# EAGLE design FuenteProto_v11 (EAGLE 6.2)
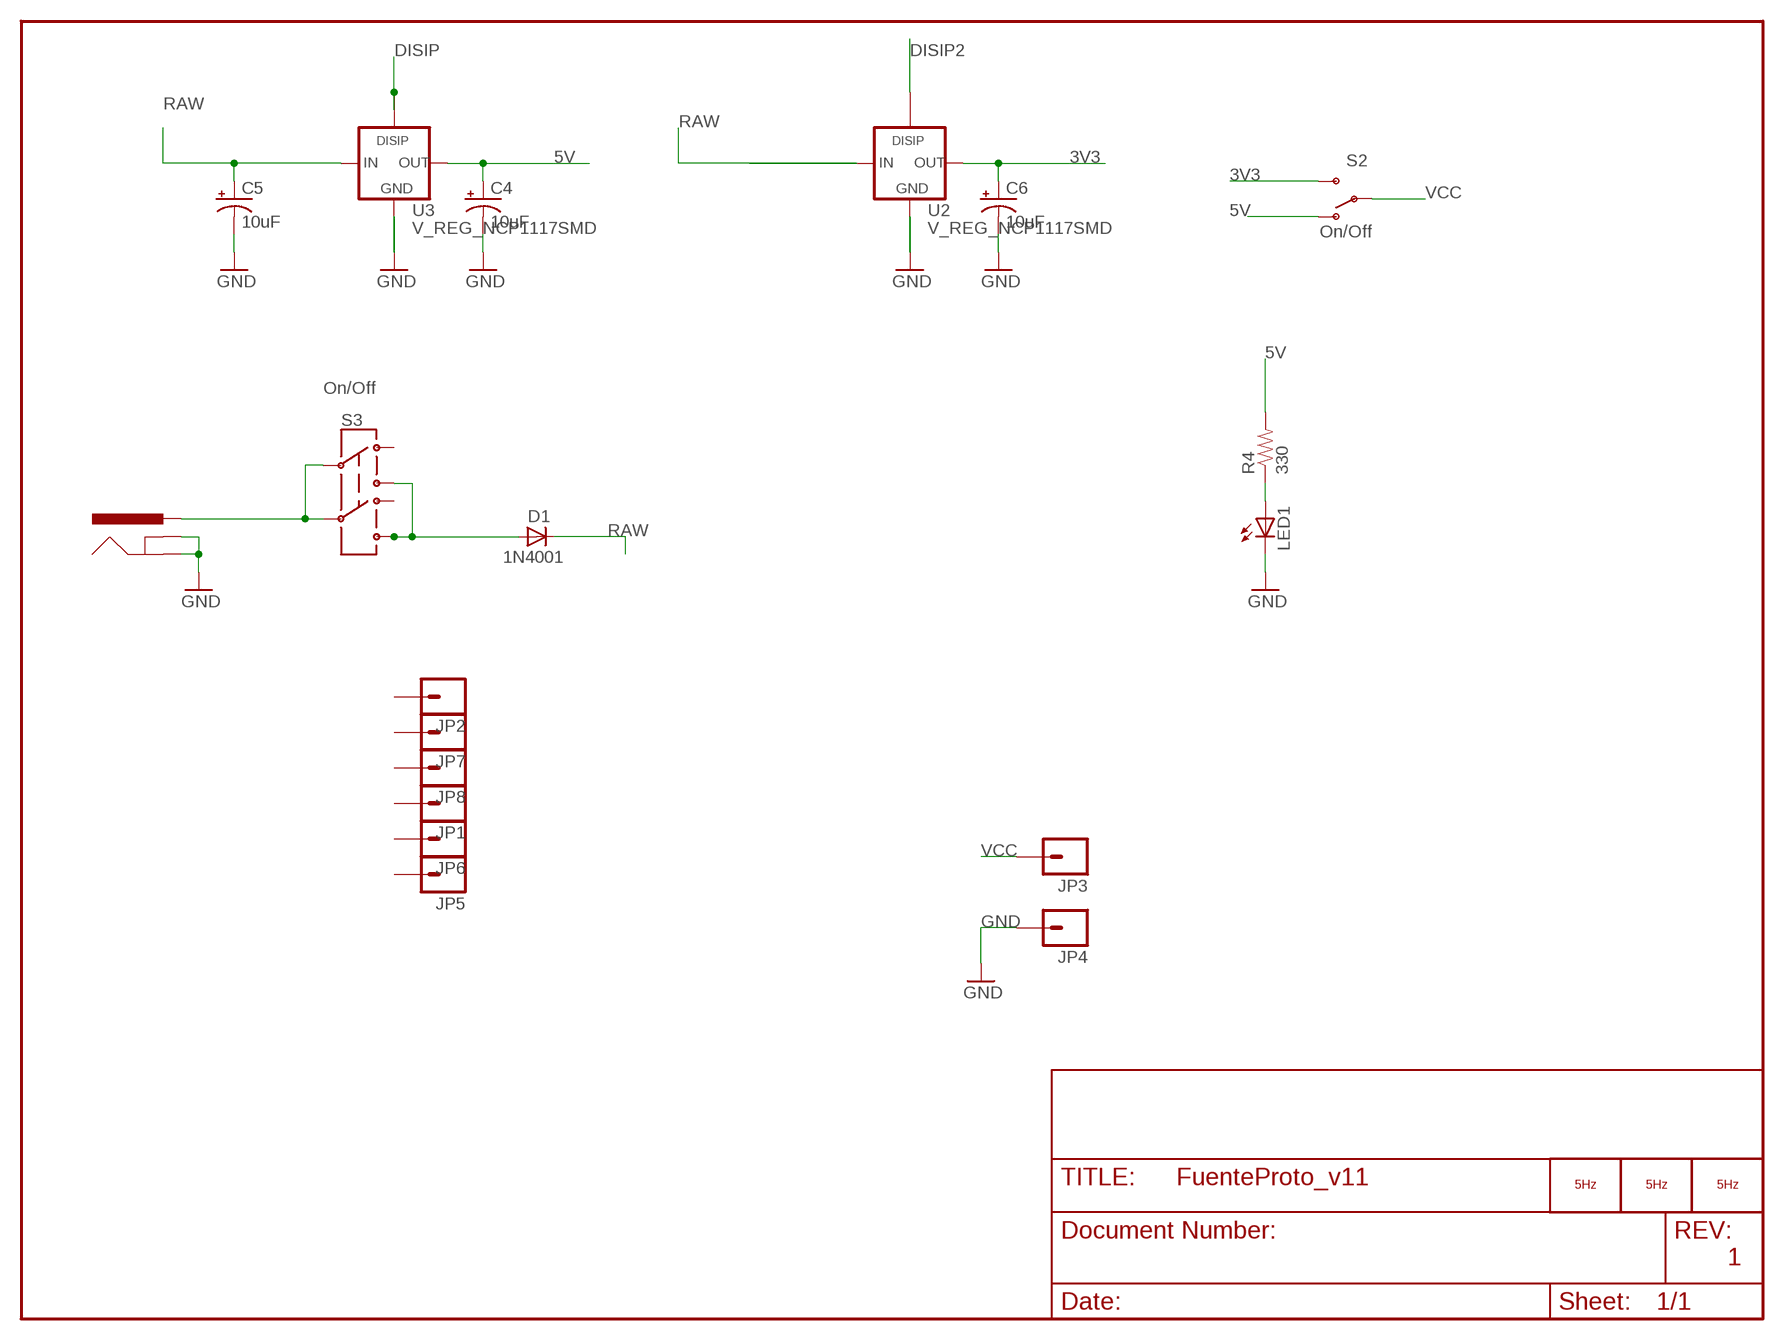
[diagram p0: schematic, sheet 1]

## Parts
C4  10uF  CAP_POL1206  [EIA3216]
C5  10uF  CAP_POL1206  [EIA3216]
C6  10uF  CAP_POL1206  [EIA3216]
D1  1N4001  DIODESMA  [SMA-DIODE]
J1  POWER_JACKPTH  [POWER_JACK_PTH]
JP1  M01PTH  [1X01]
JP2  M01PTH  [1X01]
JP3  M01PTH  [1X01]
JP4  M01PTH  [1X01]
JP5  M01PTH  [1X01]
JP6  M01PTH  [1X01]
JP7  M01PTH  [1X01]
JP8  M01PTH  [1X01]
LED1  LED0603  [LED-0603]
LOGO1  LOGO_5HZ_CIRC_3.5MM  [5HZ_LOGO_CIRC_3.5MM]
LOGO2  LOGO_5HZ_WEB_10MM  [5HZ_WEB_10MM]
LOGO3  LOGO_5HZ_H_10MM  [5HZ_LOGO_H_10MM]
R4  330  RESISTOR0603  [0603]
S2  On/Off  SWITCH-SPSTSMD  [AYZ0202]
S3  On/Off  AYZ0202  [AYZ0202]
U2  V_REG_NCP1117SMD  [SOT223]
U3  V_REG_NCP1117SMD  [SOT223]

## Nets
3V3 [vcc]: C6.A(+) S2.3(S) U2.2(OUT)
5V [vcc]: C4.A(+) R4.2 S2.1(O) U3.2(OUT)
DISIP: U3.4
DISIP2: U2.4
GND: C4.C(-) C5.C(-) C6.C(-) J1.GND J1.GNDBREAK JP4.1 LED1.C U2.1(GND) U3.1(GND)
N$2: D1.A S3.1 S3.4
N$3: J1.PWR S3.2 S3.5
N$8: LED1.A R4.1
RAW: C5.A(+) D1.C U2.3(IN) U3.3(IN)
VCC: JP3.1 S2.2(P)
Unconnected: JP1.1 JP2.1 JP5.1 JP6.1 JP7.1 JP8.1 S3.3 S3.6

## Notes on the sheet
- 1

## Library data of the parts
C4-C6 = SparkFun:CAP_POL: Capacitor Polarized These are standard SMD and PTH capacitors. Normally 10uF, 47uF, and 100uF in electrolytic and tantalum varieties. Always verify the external diameter of the through hole cap, it varies with capacity, voltage, and manufacturer. The EIA devices should be standard.
D1 = SparkFun:DIODE: Diode These are standard reverse protection diodes and small signal diodes. SMA package can handle up to about 1A. SOD-323 can handle about 200mA. What the SOD-323 package when ordering, there are some mfgs out there that are 5-pin packages.
J1 = SparkFun:POWER_JACK: Power Jack This is the standard 5.5mm barrel jack for power. The PTH is the most common, proven, reliable, footprint. All others are experimental. The Slot footprint only works if the mill layer is transmitted to the PCB fab house so be warned. Spark Fun Electronics SKU : PRT-00119. Mating wall wart : TOL-00298 (and others)
JP1-JP8 = SparkFun:M01: Header 1 Standard 1-pin 0.1" header. Use with straight break away headers (SKU : PRT-00116), right angle break away headers (PRT-00553), swiss pins (PRT-00743), machine pins (PRT-00117), and female headers (PRT-00115).
LED1 = SparkFun:LED: LEDs Standard schematic elements and footprints for 5mm, 3mm, 1206, and 0603 sized LEDs. 5mm - Spark Fun Electronics SKU : COM-00529 (and others)
LOGO1-LOGO3 = 5hz-electronica:LOGO_5HZ: Logotipo 5Hz "según Pedro"
R4 = SparkFun:RESISTOR: Resistor Basic schematic elements and footprints for 0603, 1206, and PTH 1/10th watt (small) resistors.
S2 = SparkFun:SWITCH-SPST: SPST Switch Simple slide switch. Spark Fun Electronics SKU : COM-00102
S3 = SparkFun:AYZ0202: SPDT Slide Switch Simple SMD single-pull double-throw slide switch. Good for less than 350mA power switch, switching UARTs between devices, etc. Spark Fun Electronics SKU : COM-00597
U2 U3 = 5hz-electronica:V_REG_NCP1117: Voltage Regulator The NCP1117 series are low dropout positive voltage regulators that are capable of providing an output current that is in excess of 1.0 A with a maximum dropout voltage of 1.2 V at 800 mA over temperature. This series contains eight fixed output voltages of 1.5 V, 1.8 V, 2.0 V, 2.5 V, 2.85 V, 3.3 V, 5.0 V, and 12 V that have no minimum load requirement to maintain regulation. Also included is an adjustable output version that can be programmed from 1.25 V to 18.8 V with two external resistors. On chip trimming adjusts the reference/output voltage to within ±1.0% accuracy. Internal protection features consist of output current limiting, safe operating area compensation, and thermal shutdown. The NCP1117 series can operate with up to 20 V input. Devices are available in SOT-223 and DPAK packages.

## Net classes
0 default: width 0.254 mm
1 vcc: width 0.254 mm

## Board
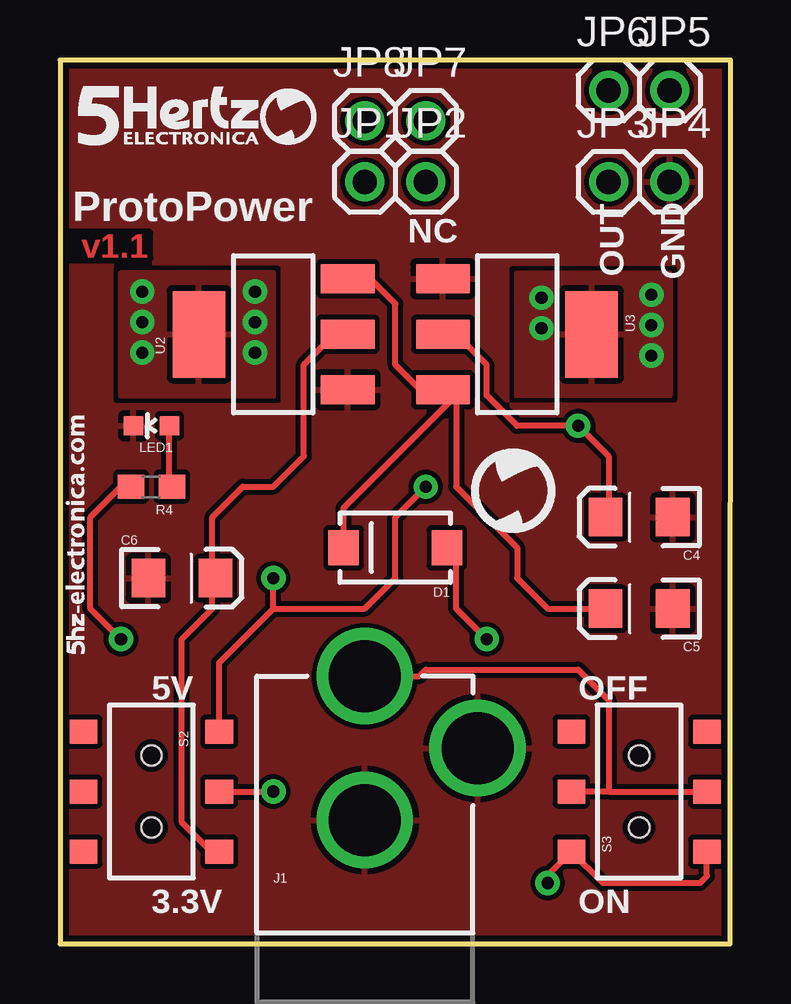
[diagram p1: board, top side]
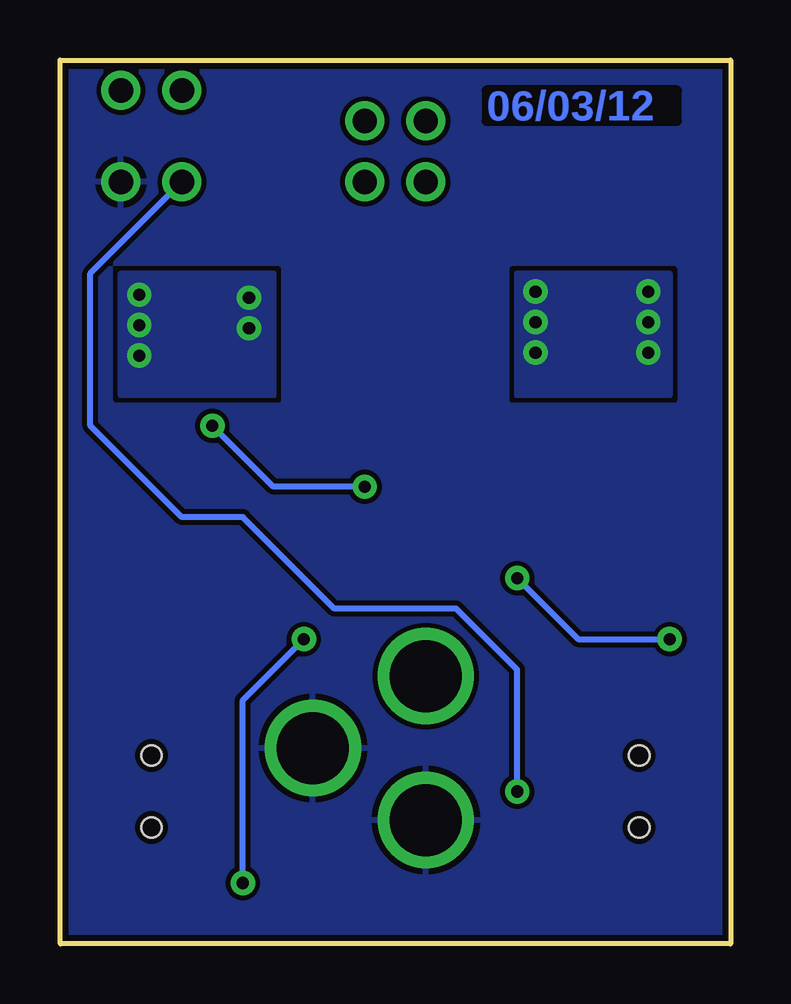
[diagram p2: board, bottom side, seen from below]

Size 27.94 x 36.83 mm. Coordinates in mm from the lower left corner, seen from the top.
Outline: 0,0 27.92,0 27.94,36.83 0,36.83 0,0
Copper layers (1*16): Top 0.035mm / dielectric 1.5mm / Bottom 0.035mm
Design rules: minimum track width 8mil, minimum drill 20mil, track to track 8mil, track to pad 8mil, pad to pad 8mil, via to via 8mil, smd to smd 8mil, copper to edge 10mil, drill to drill 8mil, minimum pad ring 12mil, minimum via ring 10mil, stop-mask expansion 4mil, vias tented up to drill 25mil, thermal gap 10mil

### Footprints (pad centres in the part's own frame; a part is rotated, then mirrored left to right if it is on the bottom)
EIA3216 = smd 1.4 x 1.6: A 1.4,0; C -1.4,0
SMA-DIODE = smd 1.27 x 1.47: A -2.15,0; C 2.15,0
POWER_JACK_PTH = drill 2.997: GND 0,7.7; GNDBREAK 4.7,10.7; PWR 0,13.7
1X01 = drill 1.016: 1 0,0
LED-0603 = smd 0.8 x 0.8: A 0,-0.75; C 0,0.75
0603 = smd 1.1 x 1: 1 -0.85,0; 2 0.85,0
AYZ0202 = smd 1 x 1.15: 1 -2.5,2.825; 2 0,2.825; 3 2.5,2.825; 4 -2.5,-2.825; 5 0,-2.825; 6 2.5,-2.825 | hole 0.85: 1.5,0; -1.5,0
SOT223 = smd 1.219 x 2.235: 1 -2.311,-3.099; 2 0,-3.099; 3 2.311,-3.099 | smd 3.6 x 2.2: 4 0,3.099

### Placement (x,y rotation side)
C4  24.13,17.78 180 top
C5  24.13,13.97 180 top
C6  5.08,15.24 0 top
D1  13.97,16.51 180 top
J1  12.7,-2.54 0 top
JP1  12.7,31.75 0 top
JP2  15.24,31.75 0 top
JP3  22.86,31.75 0 top
JP4  25.4,31.75 0 top
JP5  25.4,35.56 0 top
JP6  22.86,35.56 0 top
JP7  15.24,34.29 0 top
JP8  12.7,34.29 0 top
LED1  3.81,21.59 90 top
LOGO1  17.14,17.14 0 top
LOGO2  1.02,12.06 90 top
LOGO3  0.76,33.27 0 top
R4  3.81,19.05 180 top
S2  3.81,6.35 270 top
S3  24.13,6.35 90 top
U2  8.89,25.4 90 top
U3  19.05,25.4 270 top

### Tracks (layer width: path | path; a pad name or v marks a point on that pad's centre or on a via)
3V3
  Top 0.254: S2.3 6.31,3.85 5.08,5.08 5.08,12.7 6.35,13.97 6.35,15.11 C6.A 6.35,15.37 6.35,17.78 7.62,19.05 8.89,19.05 10.16,20.32 10.16,24.13 11.43,25.4 U2.2
5V  (via drill 0.51)
  Top 0.254: S2.1 6.63,11.71 8.89,13.97 | 8.89,13.97 12.7,13.97 13.97,15.24 13.97,17.78 v15.24,19.05 | C4.A 22.86,17.91 22.86,20.32 v21.59,21.59 19.05,21.59 17.78,22.86 17.78,24.13 16.51,25.4 U3.2 | R4.2 2.54,19.05 1.27,17.78 1.27,13.97 v2.54,12.7 | 8.89,13.97 v8.89,15.24
  Bottom 0.254: v15.24,19.05 19.05,19.05 v21.59,21.59 | v2.54,12.7 6.35,12.7 v8.89,15.24
DISIP  (via drill 0.51)
  other vias: 24.64,27.05 24.64,25.78 24.64,24.51 20.07,26.92 20.07,25.65
  pour Top: 25.4,22.86 19.05,22.86 19.05,27.94 25.4,27.94
  pour Bottom: 19.05,22.86 25.4,22.86 25.4,27.94 19.05,27.94
DISIP2  (via drill 0.51)
  other vias: 3.43,27.18 3.43,25.91 3.43,24.64 8.13,27.18 8.13,25.91 8.13,24.64
  pour Top: 2.54,27.94 2.54,22.86 8.89,22.86 8.89,27.94
  pour Bottom: 2.54,27.94 2.54,22.86 8.89,22.86 8.89,27.94
GND
  pour Bottom (rank 2): 0,36.83 0,0 27.94,0 27.94,36.83
  pour Top (rank 2): 0,36.83 0,0 27.94,0 27.94,36.83
N$2  (via drill 0.51)
  Top 0.254: D1.A 16.51,16.51 16.51,13.97 v17.78,12.7 | v20.32,2.54 20.32,2.87 S3.1 22.61,2.54 26.67,2.54 26.95,2.83 S3.4
  Bottom 0.254: v17.78,12.7 20.32,10.16 v20.32,2.54
N$3
  Top 0.254: 22.86,6.35 S3.2 | 22.86,6.35 S3.5 | J1.PWR 14.97,11.16 15.24,11.43 21.59,11.43 22.86,10.16 22.86,6.35
N$8
  Top 0.254: LED1.A 4.56,19.15 R4.1
RAW
  Top 0.254: 16.34,22.7 16.51,22.53 16.51,19.05 19.05,16.51 19.05,15.24 20.32,13.97 C5.A | D1.C 11.82,18.17 16.34,22.7 | U2.3 12.93,27.71 13.97,26.67 13.97,24.13 15.24,22.86 15.72,22.86 U3.3 16.34,22.7
VCC  (via drill 0.51)
  Top 0.254: S2.2 v8.89,6.35
  Bottom 0.254: JP3.1 26.67,27.94 26.67,21.59 22.86,17.78 20.32,17.78 16.51,13.97 11.43,13.97 8.89,11.43 v8.89,6.35

### Text on the board
Top: v1.1
Bottom: 06/03/12
tPlace: ProtoPower | NC | OUT | GND | 5V | OFF | 3.3V | ON